# EAGLE schematic tda2030a amplifier kit (EAGLE 6.2)
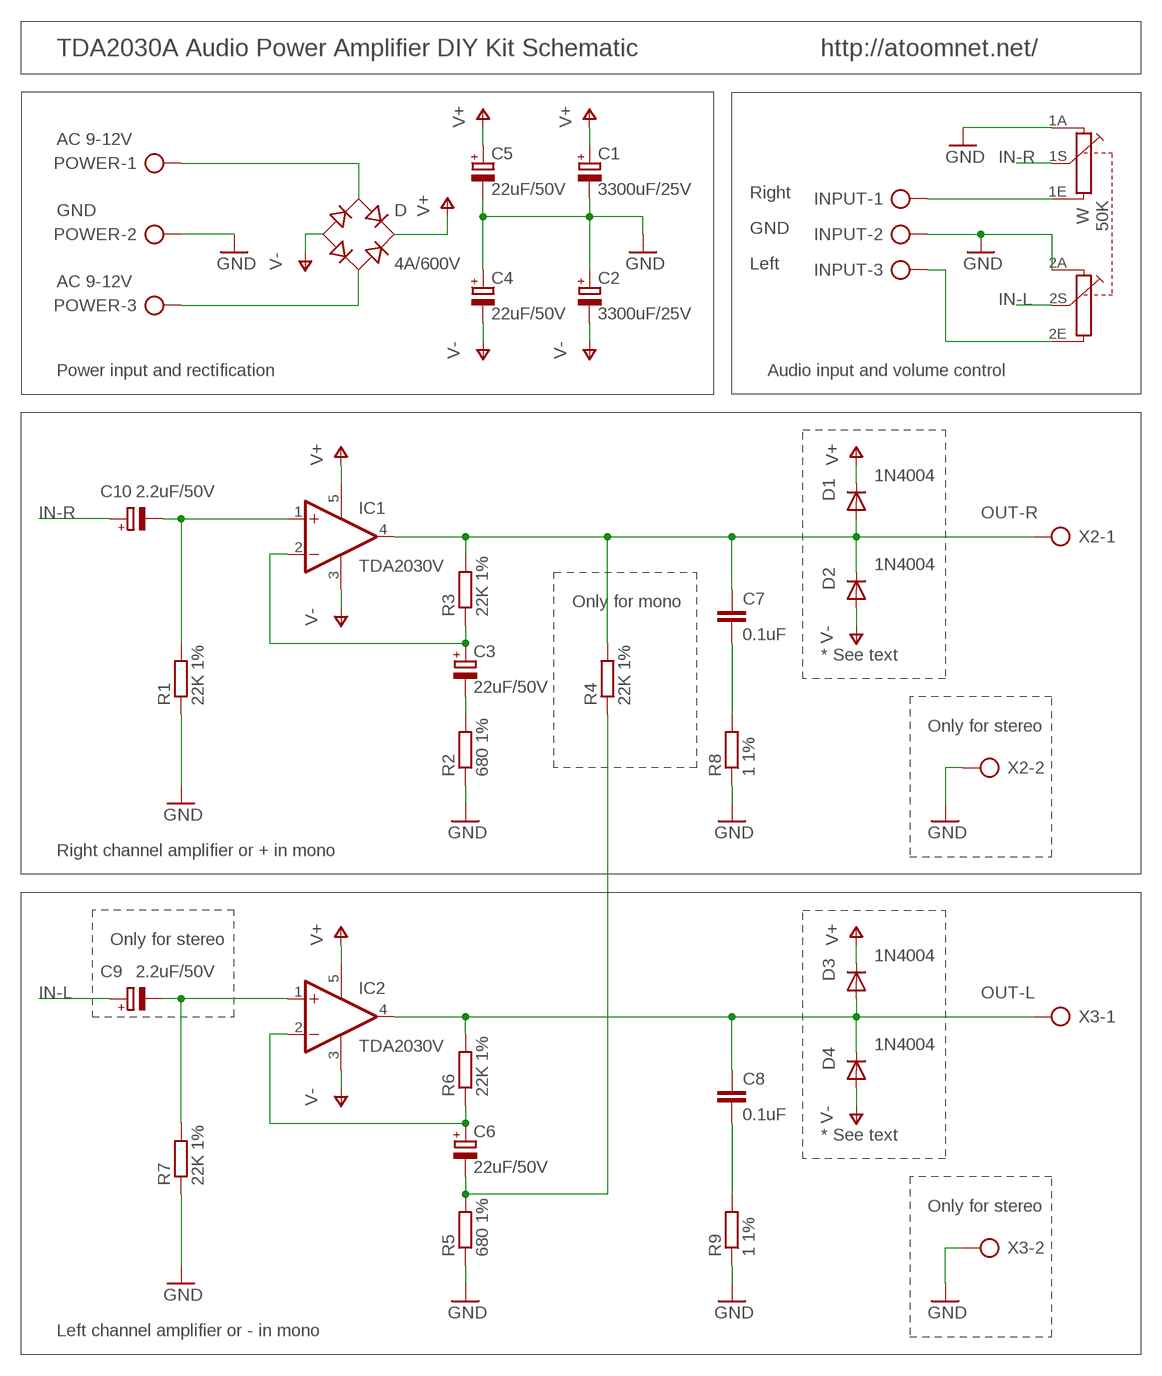
[diagram p0: schematic, sheet 1]

## Parts
C1  3300uF/25V  CPOL-EUE7.5-18  [E7,5-18]
C2  3300uF/25V  CPOL-EUE7.5-18  [E7,5-18]
C3  22uF/50V  CPOL-EUE2-5  [E2-5]
C4  22uF/50V  CPOL-EUE2-5  [E2-5]
C5  22uF/50V  CPOL-EUE2-5  [E2-5]
C6  22uF/50V  CPOL-EUE2-5  [E2-5]
C7  0.1uF  C-EU050-030X075  [C050-030X075]
C8  0.1uF  C-EU050-030X075  [C050-030X075]
C9  2.2uF/50V  CPOL-EUE2-5  [E2-5]
C10  2.2uF/50V  CPOL-EUE2-5  [E2-5]
D  4A/600V  RECTIFIER-FBU4  [FBU4]
D1  1N4004  [DO41-10]
D2  1N4004  [DO41-10]
D3  1N4004  [DO41-10]
D4  1N4004  [DO41-10]
IC1  TDA2030V  [CB360]
IC2  TDA2030V  [CB360]
INPUT  AK500/3  [AK500/3]
POWER  AK500/3  [AK500/3]
R1  22K 1%  R-EU_0207/10  [0207/10]
R2  680 1%  R-EU_0207/10  [0207/10]
R3  22K 1%  R-EU_0207/10  [0207/10]
R4  22K 1%  R-EU_0207/10  [0207/10]
R5  680 1%  R-EU_0207/10  [0207/10]
R6  22K 1%  R-EU_0207/10  [0207/10]
R7  22K 1%  R-EU_0207/10  [0207/10]
R8  1 1%  R-EU_0207/10  [0207/10]
R9  1 1%  R-EU_0207/10  [0207/10]
W  50K  PC16D  [PC16D]
X2  AK500/2  [AK500/2]
X3  AK500/2  [AK500/2]

## Nets
GND: C1.- C2.+ C4.+ C5.- INPUT.2 POWER.2 R1.1 R2.1 R5.1 R7.1 R8.1 R9.1 W.1A W.2A X2.2 X3.2
IN-L: C9.+ W.2S
IN-R: C10.+ W.1S
N$1: D.AC1 POWER.1
N$2: D.AC2 POWER.3
N$3: INPUT.1 W.1E
N$4: INPUT.3 W.2E
N$5: C10.- IC1.1(+IN) R1.2
N$6: C9.- IC2.1(+IN) R7.2
N$7: C3.+ IC1.2(-IN) R3.1
N$8: C3.- R2.2
N$9: C7.2 R8.2
N$10: C8.2 R9.2
N$12: C6.- R4.1 R5.2
N$13: C6.+ IC2.2(-IN) R6.1
OUT-L: C8.1 D3.A D4.C IC2.4(OUT) R6.2 X3.1
OUT-R: C7.1 D1.A D2.C IC1.4(OUT) R3.2 R4.2 X2.1
V+: C1.+ C5.+ D1.C D3.C D.+ IC1.5(V+) IC2.5(V+)
V-: C2.- C4.- D2.A D4.A D.- IC1.3(GND) IC2.3(GND)

## Notes on the sheet
- TDA2030A Audio Power Amplifier DIY Kit Schematic | http://atoomnet.net/
- AC 9-12V
- Right
- GND
- GND
- Left
- AC 9-12V
- Power input and rectification | Audio input and volume control
- Only for mono
- * See text
- Only for stereo
- Right channel amplifier or + in mono
- Only for stereo
- * See text
- Only for stereo
- Left channel amplifier or - in mono

## Library data of the parts
C1-C6 C9 C10 = rcl:CPOL-EU: POLARIZED CAPACITOR, European symbol
C7 C8 = rcl:C-EU: CAPACITOR, European symbol
D = rectifier:RECTIFIER-: Rectifier
D1-D4 = diode:1N4004: DIODE general purpose rectifier, 1 A
IC1 IC2 = linear:TDA2030: Power OP AMP
INPUT POWER = con-ptr500:AK500/3: CONNECTOR; OC_FARNELL: unknown; OC_NEWARK: unknown
R1-R9 = rcl:R-EU_: RESISTOR, European symbol
W = piher:PC16D: POTENTIOMETER tandem carbon potentiometer, 16 mm, S3ROH; OC_FARNELL: 4453049; OC_NEWARK: unknown
X2 X3 = con-ptr500:AK500/2: CONNECTOR; OC_FARNELL: unknown; OC_NEWARK: unknown